# Altium schematic sheet Bluetooth.SchDoc
size A; SheetNumber: 3; SheetTotal: 3
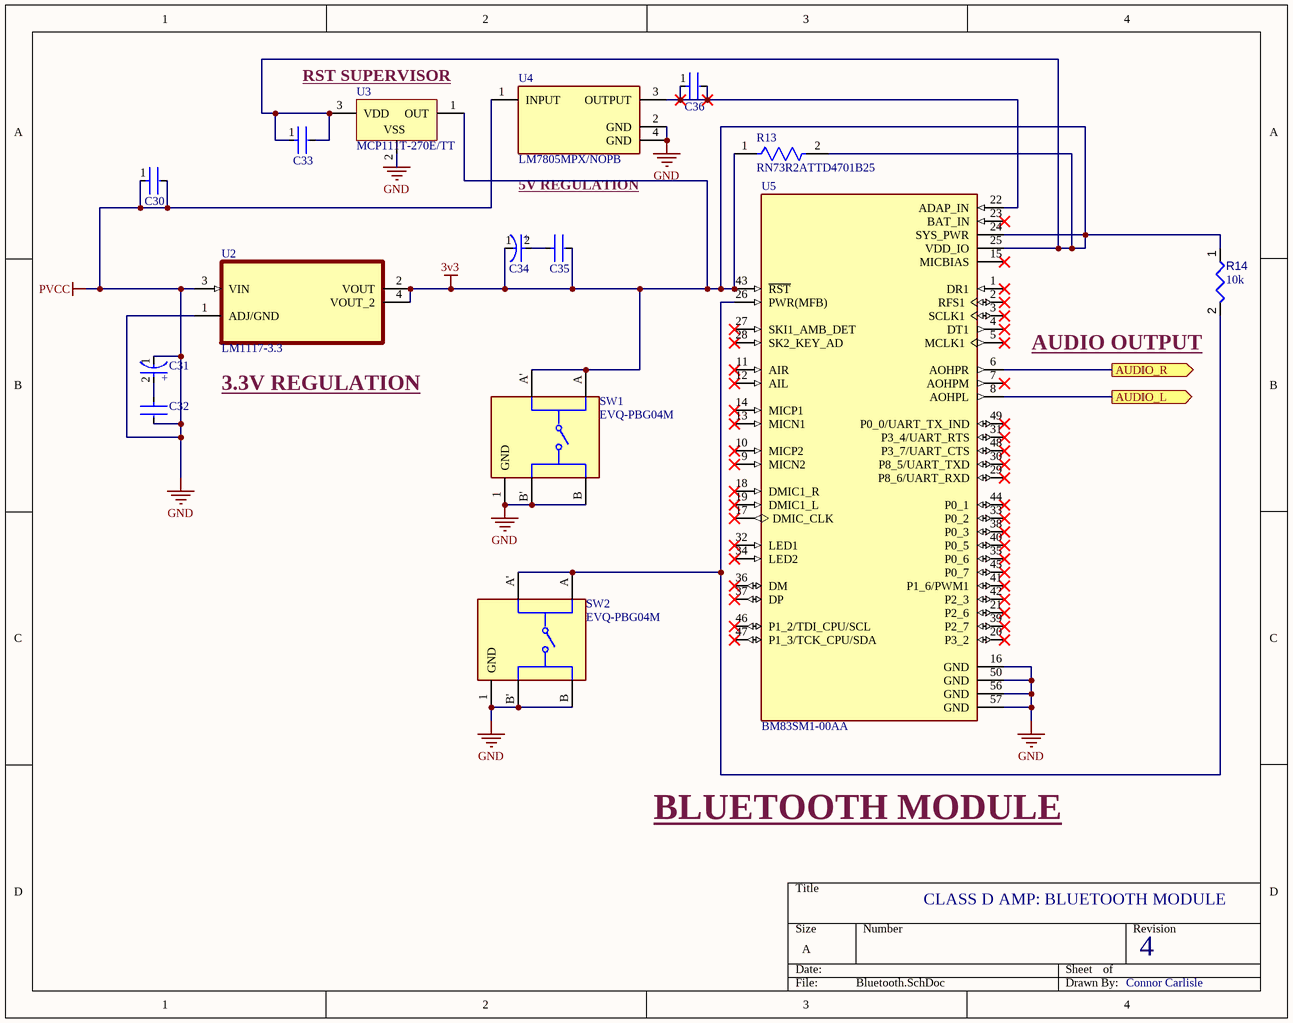
[diagram p0: Bluetooth.SchDoc]

## Parts
C30  JWK105BJ104MP-F  [FP-0204-L_0_52_0_05-W_1_0-IPC_C]  (value not drawn)
C31  ECA1HHG100I  [FP-RAD-TH-D_5_0_5-L_11_1-MFG]  (value not drawn)
C32  JWK105BJ104MP-F  [FP-0204-L_0_52_0_05-W_1_0-IPC_C]  (value not drawn)
C33  JWK105BJ104MP-F  [FP-0204-L_0_52_0_05-W_1_0-IPC_C]  (value not drawn)
C34  ECA1HHG100I  [FP-RAD-TH-D_5_0_5-L_11_1-MFG]  (value not drawn)
C35  JWK105BJ104MP-F  [FP-0204-L_0_52_0_05-W_1_0-IPC_C]  (value not drawn)
C36  JWK105BJ104MP-F  [FP-0204-L_0_52_0_05-W_1_0-IPC_C]  (value not drawn)
R13  RN73R2ATTD4701B25  [FP-RN73R2A-IPC_C]
R14  value 10k  [RESA60-630X240]  (hidden comment: MFR-25FBF52-10K)
SW1  EVQ-PBG04M  [FP-EVQ-PBG04M-MFG]
SW2  EVQ-PBG04M  [FP-EVQ-PBG04M-MFG]
U2  LM1117-3.3  [SOT230]
U3  MCP111T-270E/TT  [SOT-23-TT3_N]
U4  LM7805MPX/NOPB  [FP-LM7805MPX-NOPB-MFG]
U5  BM83SM1-00AA  [XCVR_BM83SM1-00AA]

## Ports
AUDIO_L (out), AUDIO_R (out)

## Nets
3v3: C33.1 C33.2 C34.1(C) C35.2 R13.1 R13.2 R14.1 SW1.A SW1.A' U2.2(VOUT) U2.4(VOUT_2) U3.1(OUT) U3.3(VDD) U5.24(SYS_PWR) U5.25(VDD_IO) U5.43(~{RST})
GND: C30.1 C30.2 C31.1(C) C32.2 SW1.1(GND) SW1.B SW1.B' SW2.1(GND) SW2.B SW2.B' U2.1(ADJ/GND) U2.3(VIN) U3.2(VSS) U4.1(INPUT) U4.2(GND) U4.4(GND) U5.16(GND) U5.50(GND) U5.56(GND) U5.57(GND)  [also labelled PVCC]
AUDIO_L: U5.8(AOHPL) ; port AUDIO_L
AUDIO_R: U5.6(AOHPR) ; port AUDIO_R
NetC31_2: C31.2(A) C32.1
NetC34_2: C34.2(A) C35.1
NetC36_1: C36.1 C36.2 U4.3(OUTPUT) U5.22(ADAP_IN)
NetR14_2: R14.2 SW2.A SW2.A' U5.26(PWR(MFB))

Not connected (* = marked no-connect by the designer): U5 1(DR1)* 2(RFS1)* 3(SCLK1)* 4(DT1)* 5(MCLK1)* 7(AOHPM)* 9(MICN2)* 10(MICP2)* 11(AIR)* 12(AIL)* 13(MICN1)* 14(MICP1)* 15(MICBIAS)* 17(DMIC_CLK)* 18(DMIC1_R)* 19(DMIC1_L)* 20(P3_2)* 21(P2_6)* 23(BAT_IN)* 27(SKI1_AMB_DET)* 28(SK2_KEY_AD)* 29(P8_6/UART_RXD)* 30(P8_5/UART_TXD)* 31(P3_4/UART_RTS)* 32(LED1)* 33(P0_2)* 34(LED2)* 35(P0_6)* 36(DM)* 37(DP)* 38(P0_3)* 39(P2_7)* 40(P0_5)* 41(P1_6/PWM1)* 42(P2_3)* 44(P0_1)* 45(P0_7)* 46(P1_2/TDI_CPU/SCL)* 47(P1_3/TCK_CPU/SDA)* 48(P3_7/UART_CTS)* 49(P0_0/UART_TX_IND)*

## Notes on the sheet
- (near U3) RST SUPERVISOR
- 5V REGULATION
- AUDIO OUTPUT
- 3.3V REGULATION
- BLUETOOTH MODULE
- CLASS D AMP: BLUETOOTH MODULE
- 4
- Connor Carlisle
- (in symbol CMP-05427-000260-1) +

## Library data of the parts
C30 C32 C33 C35 C36 = CMP-14477-001862-2: .1 microfarad; Voltage Rating (DC): 6.3V; Tolerance: 20%; Capacitance: 100nF; RoHS Compliant: Yes; Halogen Free: Halogen Free
C31 C34 = CMP-05427-000260-1: Aluminum Electrolytic Capacitors (Radial Lead Type) AEC-Q200 Qualified 10uF ±20% 50V; Lead Diameter: 0.5mm; Polarity: Polar; Leakage Current: 3uA; Life (Hours): 1000Hour; Ripple Current: 39mA; Lead/Base Style: Straight; Max Operating Temperature: 105°C; Voltage Rating (DC): 50V; Diameter: 5mm; RoHS Compliant: Yes; Capacitance: 10uF; Packaging: Ammo Pack; Series: NHG; Construction: RADIAL; Length: 11mm; Tolerance: 20%; Height - Seated (Max): 0.472inch; Contact Plating: Tin; Height: 11mm; Min Operating Temperature: -55°C; Radiation Hardening: No; Package Quantity: 2000; Mount: Through Hole; Voltage Rating: 50V; Lead Pitch: 2.5mm; Termination: Radial; Lead Free: Lead Free; Case/Package: Radial
R13 = CMP-04015-010540-1: 4.7kΩ ±0.1% 0.125W, 1/8W Chip Resistor 0805 (2012 Metric) Moisture Resistant Thin Film
R14 = CMP-009-00047-4: Axial Resistor, 10 KOhm, +/- 1%, 0.25 W, -55 to 155 degC, 2-Pin THD, RoHS, Bulk; Manufacturer: Yageo; Power: 250mW; Voltage Rating: 250V; Manufacturer URL: http://www.yageo.com/; Datasheet URL: http://www.yageo.com/documents/recent/Yageo%20LR_MFR_2013.pdf; Package Reference: MFR-25; Min Operating Temperature: -55°C; Mounting Technology: TH; Package Quantity: 200; Case/Package: Axial; Tolerance: 1%; RoHS Compliant: True; Datasheet Version: Apr-13; Packaging: Bulk; Max Operating Temperature: 155°C; Package Description: 2-Pin Axial Lead, Dia 2.4 mm, Body Length 6.3 mm
SW1 SW2 = CMP-05618-000021-1: SWITCH TACTILE SPST-NO 0.02A 15V; Actuator Length: 0.4mm; Actuator Type: Standard; Actuator Color: White; Current Rating: 20mA; Electrical Life: 50000Cycles; Switch Travel: 0.25mm; Contact Resistance: 50mR; Operating Force: 2.6N; Illumination Type: Non-Illuminated; Throw Configuration: SPST; Switch Function: Off-Mom; Size: 6mm; Lead Free: Lead Free; Series: EVQPB; Radiation Hardening: No; Package Quantity: 500; Max Operating Temperature: 70°C; Contact Current Rating: 20mA; Max Voltage Rating (DC): 15V; Packaging: Bulk; RoHS Compliant: Yes; Mount: Through Hole; Termination: PC Pin; Orientation: Straight; Voltage Rating (DC): 15V; Min Operating Temperature: -20°C; Mechanical Life: 50000Cycles
U2 = CMP-010-000000-6: Regulador de tensÃ£o linear IC 1 Output 800mA SOT-223-4; MF: Texas Instruments; MP: LM1117-3.3; Source: SnapEDAsch.SchLib; Price: None; Pin Count: 4; SnapEDA_Link: https://www.snapeda.com/parts/LM1117-3.3/Texas%20Instruments/view-part/549181/?ref=snap; Value: *; Package: SOT-223-4 Texas Instruments; Design Item ID: LM1117-3.3; Availability: Unavailable; Component Type: Standard
U3 = CMP-019-00050-1: Microchip MCP111T-270E/TT, Voltage Supervisor 2.564 to 2.696 V, 3-PIN SOT-23B; Min Supply Voltage: 1V; Nominal Supply Current: 1µA; Max Supply Voltage: 5.5V; Max Operating Temperature: 125°C; Mounting Technology: Surface Mount; Pins: 3; Case/Package: SOT-23; Min Operating Temperature: -40°C
U4 = CMP-04917-000022-1: IC REG LINEAR 5V 1.5A SOT223-4; Manufacturer: Texas Instruments; Dropout Voltage: 2V; Output Type: Fixed; Accuracy Percentage: 3%; Nominal Supply Current: 8mA; Standoff Height: 0.02mm; Min Supply Voltage: 7.5V; Number Of Outputs: 1; Max Junction Temp: +150°C; Max Supply Voltage: 30V; Height: 1.8mm; Temperature Range High: +125°C; Device Class L3: Voltage Regulators - Linear; Lead Free: Yes; Digikey Description: IC REG LINEAR 5V 1.5A SOT223-4; Output Current: 1.5A; Manufacturer Part Number: LM7805MPX/NOPB; Automotive: No; Device Class L1: Integrated Circuits (ICs); ComponentLink2Description: Datasheet; Device Class L2: Power Management ICs; Category: IC; Octopart: https://octopart.com/lm7805mpx%2Fnopb-texas+instruments-74629992; Package: SOT223-4; RoHS: TRUE; Output Voltage: 5V; Temperature Range Low: 0°C; Temperature: 0°C to +125°C; ComponentLink2URL: http://www.ti.com/lit/ds/symlink/lm7800.pdf
U5 = CMP-008-000000-1: Bluetooth Bluetooth v5.0 Transceiver Module 2.4GHz ~ 2.48GHz PCB Trace Surface Mount; MF: Microchip Technology; MP: BM83SM1-00AA; Package: None; Pin Count: 52; Design Item ID: BM83SM1-00AA; Check_prices: https://www.snapeda.com/parts/BM83SM1-00AA/Microchip/view-part/?ref=eda; Component Type: Standard; SnapEDA_Link: https://www.snapeda.com/parts/BM83SM1-00AA/Microchip/view-part/?ref=snap; Value: *; Source: BM83SM1-00AA.SchLib